# Altium schematic sheet UART_RS485.schdoc
size 238 x 113 mm
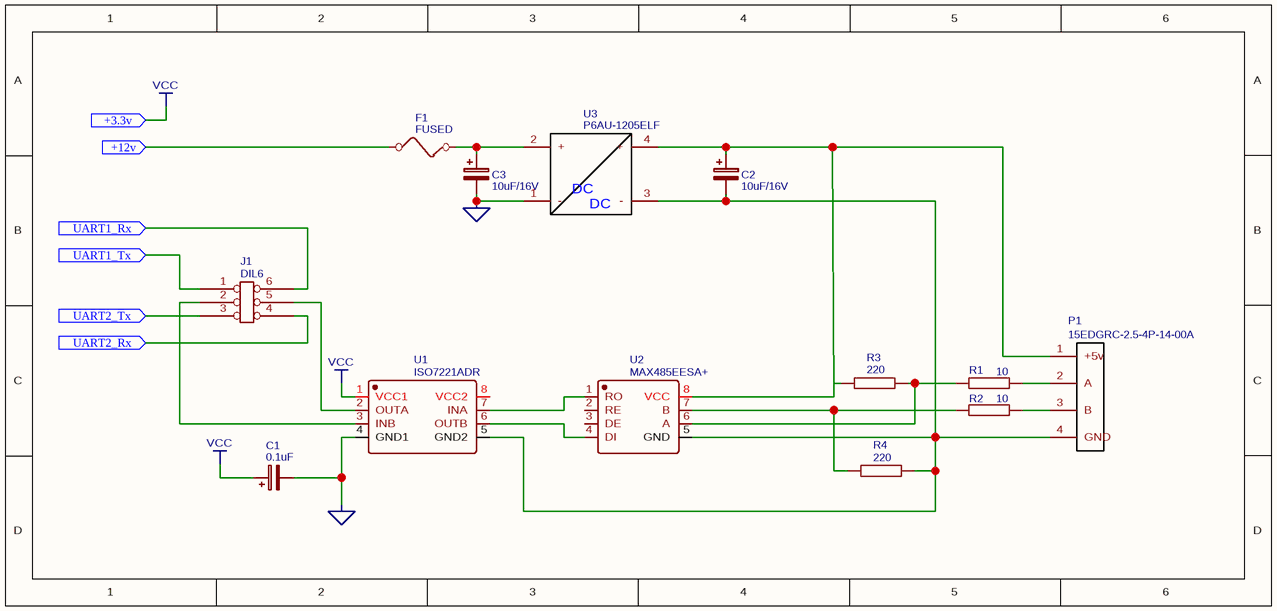
[diagram p0: UART_RS485.schdoc]

## Parts
C1  0.1uF  [NONE]
C2  10uF/16V  [NONE]
C3  10uF/16V  [NONE]
F1  FUSED  [MF-USMF075-2 COPY]
J1  DIL6  [NONE]
P1  15EDGRC-2.5-4P-14-00A  [15EDGRC-2.5-04P-14-00A(H)]
R1  10  [NONE]
R2  10  [NONE]
R3  220  [NONE]
R4  220  [NONE]
U1  ISO7221ADR  [SOIC-8]
U2  MAX485EESA+  [SOIC-8]
U3  P6AU-1205ELF  [DIP]

## Ports
+3.3v, +12v, UART1_Rx, UART1_Tx, UART2_Rx, UART2_Tx

## Nets
GND: C1.2 C3.2 U1.4(GND1) U3.1(-)
VCC: C1.1 U1.1(VCC1) ; port +3.3v
+12v: F1.1 ; port +12v
UART1_Rx: J1.6(P6) ; port UART1_Rx
UART1_Tx: J1.1(P1) ; port UART1_Tx
UART2_Rx: J1.4(P4) ; port UART2_Rx
UART2_Tx: J1.3(P3) ; port UART2_Tx
NetC2_1: C2.1 P1.1(+5v) R3.1 U2.8(VCC) U3.4(+)
NetC2_2: C2.2 P1.4(GND) R4.2 U1.5(GND2) U2.5(GND) U3.3(-)
NetC3_1: C3.1 F1.2 U3.2(+)
NetJ1_2: J1.2(P2) U1.3(INB)
NetJ1_5: J1.5(P5) U1.2(OUTA)
NetP1_2: P1.2(A) R1.2
NetP1_3: P1.3(B) R2.2
NetR1_1: R1.1 R3.2 U2.6(A)
NetR2_1: R2.1 R4.1 U2.7(B)
NetU1_6: U1.6(OUTB) U2.4(DI)
NetU1_7: U1.7(INA) U2.1(RO)

Not connected (* = marked no-connect by the designer): U1 8(VCC2); U2 2(RE) 3(DE)

## Notes on the sheet
- (in symbol U3) DC / DC

## Library data of the parts
C1-C3 J1 = (no symbol name): Contributor: KiCAD; license: https://www.gnu.org/licenses/lgpl-2.1.html; BOM_Manufacturer Part: ?
  C1-C3: spicePre: C
  J1: spicePre: J
R1-R4 = (no symbol name): Contributor: KiCad; BOM_Manufacturer Part: ?; spicePre: R
U3 = (no symbol name): Contributor: nick+alvarado; sourceId: DJVus2CA9; BOM_Manufacturer Part: ?; spicePre: U
F1 P1 U1 U2 = (no symbol name)
  F1: BOM_Manufacturer Part: ?; spicePre: F
  P1: BOM_Supplier: kds-group.ru; BOM_Manufacturer Part: 15EDGRC-2.5-4P-14-00A; spicePre: P
  U1 U2: spicePre: X; BOM_Manufacturer Part: ?